# EAGLE design tap_test (EAGLE 9.6.2)
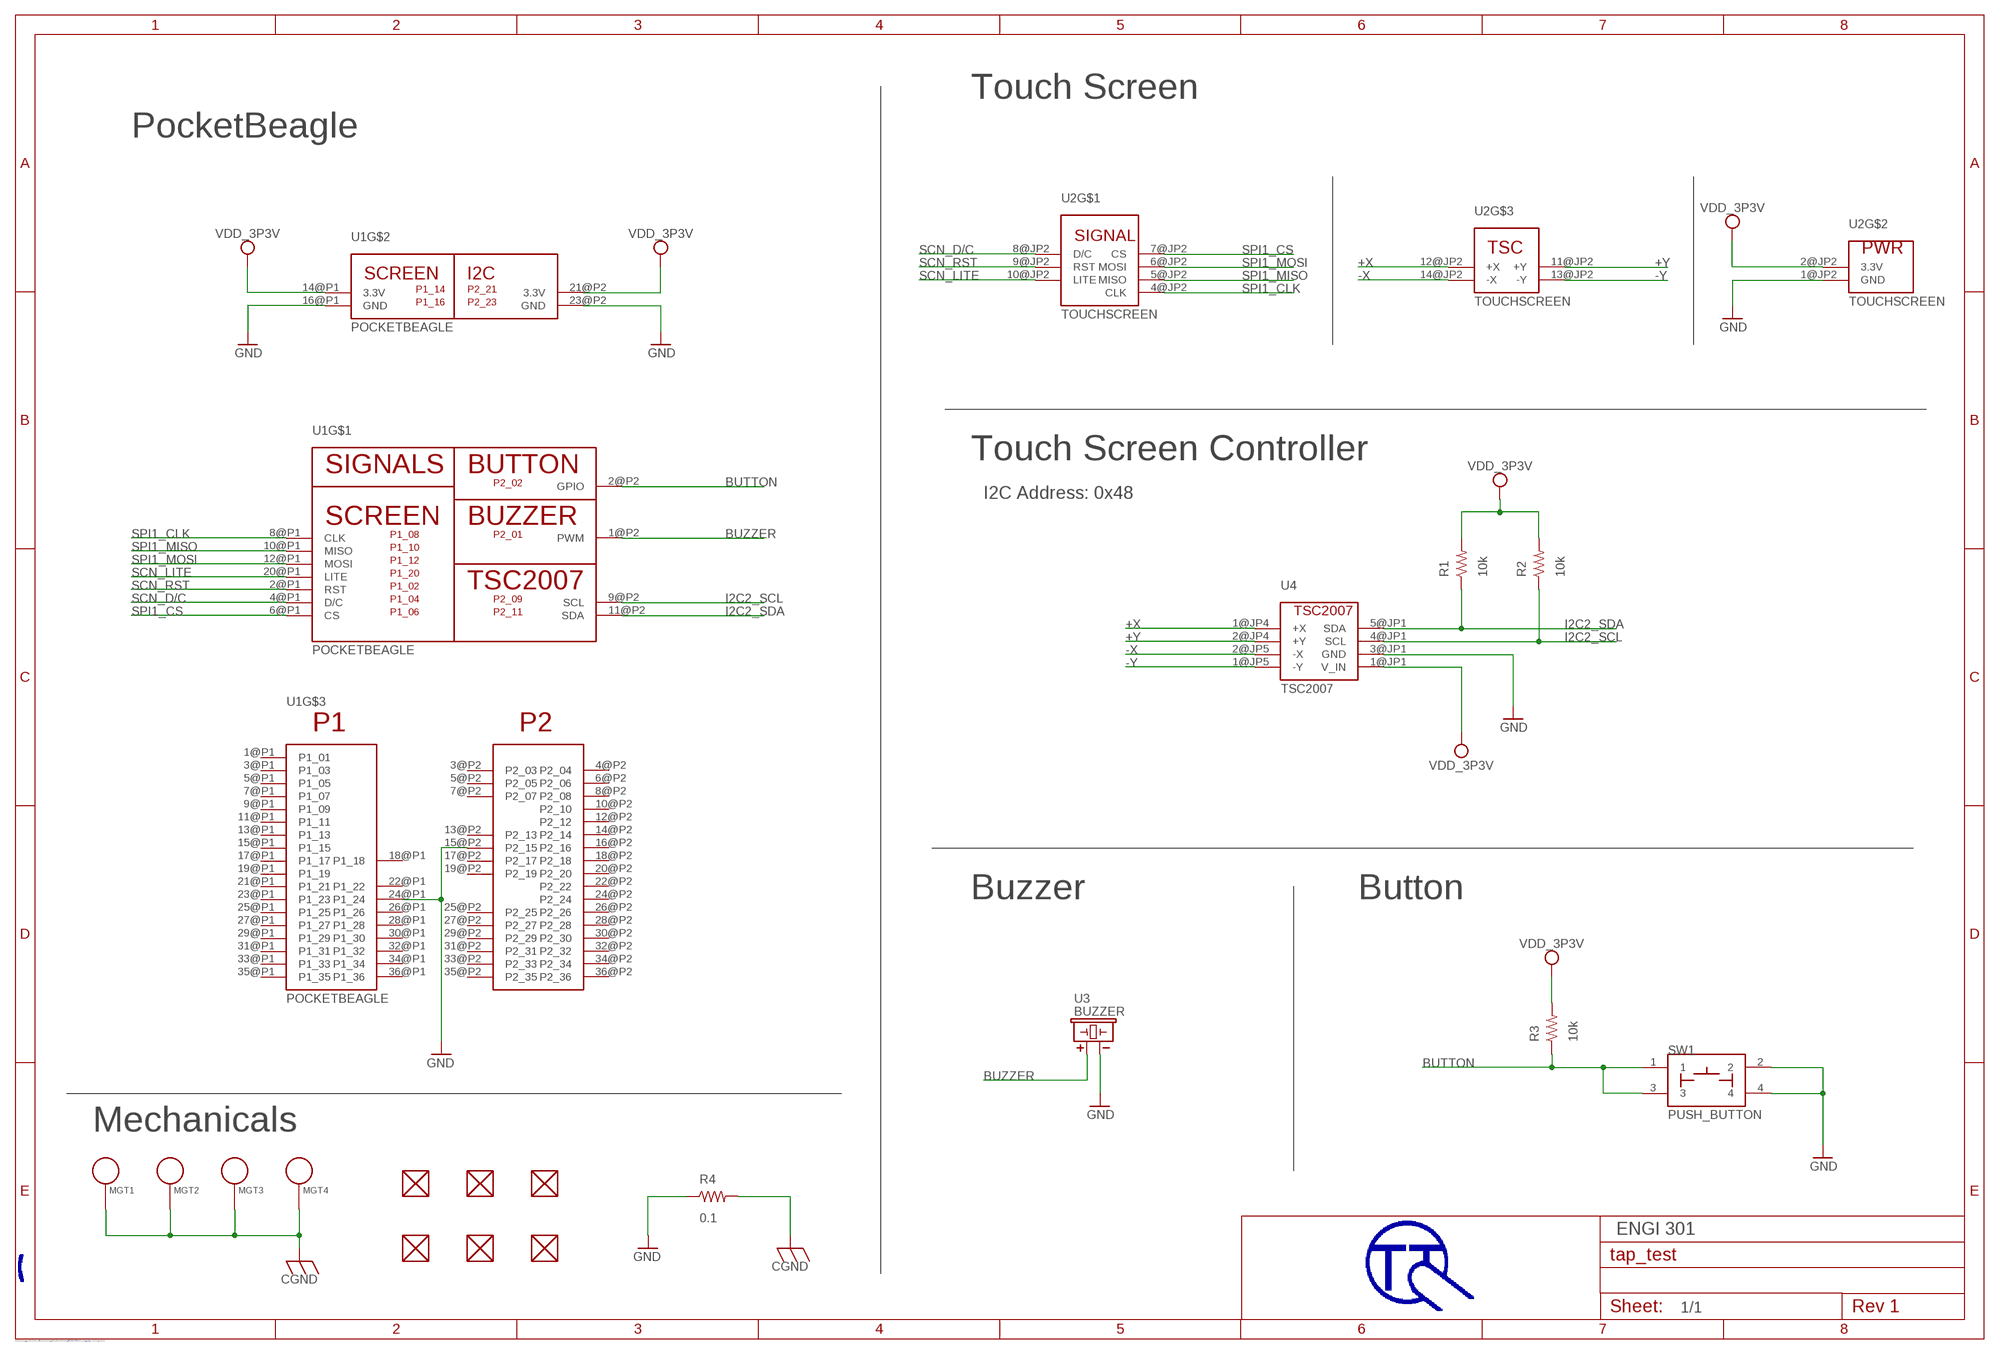
[diagram p0: schematic, sheet 1]

## Parts
FUD1  FIDUCIAL  [FIDUCIAL_40MIL]
FUD2  FIDUCIAL  [FIDUCIAL_40MIL]
FUD3  FIDUCIAL  [FIDUCIAL_40MIL]
FUD4  FIDUCIAL  [FIDUCIAL_40MIL]
FUD5  FIDUCIAL  [FIDUCIAL_40MIL]
FUD6  FIDUCIAL  [FIDUCIAL_40MIL]
MGT1  MOUNTING_HOLE  [MOUNTING_HOLE]
MGT2  MOUNTING_HOLE  [MOUNTING_HOLE]
MGT3  MOUNTING_HOLE  [MOUNTING_HOLE]
MGT4  MOUNTING_HOLE  [MOUNTING_HOLE]
R1  10k  R_R0603  [R0603]
R2  10k  R_R0603  [R0603]
R3  10k  R_R0603  [R0603]
R4  0.1  R_R0603  [R0603]
SW1  PUSH_BUTTON  [BUTTON_12.5MM]
U1  POCKETBEAGLE  [POCKETBEAGLE]
U2  TOUCHSCREEN  [TOUCHSCREEN]
U3  BUZZER  [BUZZER_6.5MM]
U4  TSC2007  [TSC2007]

## Nets
+X: U2.12@JP2(+X) U4.1@JP4(+X)
+Y: U2.11@JP2(+Y) U4.2@JP4(+Y)
-X: U2.14@JP2(-X) U4.2@JP5(-X)
-Y: U2.13@JP2(-Y) U4.1@JP5(-Y)
BUTTON: R3.1 SW1.1 SW1.3 U1.2@P2(GPIO)
BUZZER: U1.1@P2(PWM) U3.+
CGND: MGT1.P$1 MGT2.P$1 MGT3.P$1 MGT4.P$1 R4.2
GND: R4.1 SW1.2 SW1.4 U1.15@P2(P2_15) U1.16@P1(GND) U1.23@P2(GND) U1.24@P1(P1_24) U2.1@JP2(GND) U3.- U4.3@JP1(GND)
I2C2_SCL: R2.1 U1.9@P2(SCL) U4.4@JP1(SCL)
I2C2_SDA: R1.1 U1.11@P2(SDA) U4.5@JP1(SDA)
SCN_D/C: U1.4@P1(D/C) U2.8@JP2(D/C)
SCN_LITE: U1.20@P1(LITE) U2.10@JP2(LITE)
SCN_RST: U1.2@P1(RST) U2.9@JP2(RST)
SPI1_CLK: U1.8@P1(CLK) U2.4@JP2(CLK)
SPI1_CS: U1.6@P1(CS) U2.7@JP2(CS)
SPI1_MISO: U1.10@P1(MISO) U2.5@JP2(MISO)
SPI1_MOSI: U1.12@P1(MOSI) U2.6@JP2(MOSI)
VDD_3P3V: R1.2 R2.2 R3.2 U1.14@P1(3.3V) U1.21@P2(3.3V) U2.2@JP2(3.3V) U4.1@JP1(V_IN)
Unconnected: FUD1.P$1 FUD2.P$1 FUD3.P$1 FUD4.P$1 FUD5.P$1 FUD6.P$1 U1.1@P1(P1_01) U1.3@P1(P1_03) U1.3@P2(P2_03) U1.4@P2(P2_04) U1.5@P1(P1_05) U1.5@P2(P2_05) U1.6@P2(P2_06) U1.7@P1(P1_07) U1.7@P2(P2_07) U1.8@P2(P2_08) U1.9@P1(P1_09) U1.10@P2(P2_10) U1.11@P1(P1_11) U1.12@P2(P2_12) U1.13@P1(P1_13) U1.13@P2(P2_13) U1.14@P2(P2_14) U1.15@P1(P1_15) U1.16@P2(P2_16) U1.17@P1(P1_17) U1.17@P2(P2_17) U1.18@P1(P1_18) U1.18@P2(P2_18) U1.19@P1(P1_19) U1.19@P2(P2_19) U1.20@P2(P2_20) U1.21@P1(P1_21) U1.22@P1(P1_22) U1.22@P2(P2_22) U1.23@P1(P1_23) U1.24@P2(P2_24) U1.25@P1(P1_25) U1.25@P2(P2_25) U1.26@P1(P1_26) U1.26@P2(P2_26) U1.27@P1(P1_27) U1.27@P2(P2_27) U1.28@P1(P1_28) U1.28@P2(P2_28) U1.29@P1(P1_29) U1.29@P2(P2_29) U1.30@P1(P1_30) U1.30@P2(P2_30) U1.31@P1(P1_31) U1.31@P2(P2_31) U1.32@P1(P1_32) U1.32@P2(P2_32) U1.33@P1(P1_33) U1.33@P2(P2_33) U1.34@P1(P1_34) U1.34@P2(P2_34) U1.35@P1(P1_35) U1.35@P2(P2_35) U1.36@P1(P1_36) U1.36@P2(P2_36)

## Notes on the sheet
- Touch Screen
- PocketBeagle
- Touch Screen Controller | I2C Address: 0x48
- Buzzer | Button
- Mechanicals
- ENGI 301
- 1/1
- C:/Users/waywi/OneDrive - Rice University/Sophmore Spring/ENGI 301/pcb_design/tap_test_logo.bmp

## Library data of the parts
FUD1-FUD6 = tap_test:FIDUCIAL
MGT1-MGT4 = tap_test:MOUNTING_HOLE: Chassis Mounting Hole w/GND connection ability
R1-R4 = tap_test:R_: RESISTOR, American symbol
SW1 = tap_test:PUSH_BUTTON
U1 = tap_test:POCKETBEAGLE
U2 = tap_test:TOUCHSCREEN
U3 = tap_test:BUZZER: CEM-1203 Buzzer
U4 = tap_test:TSC2007

## Board
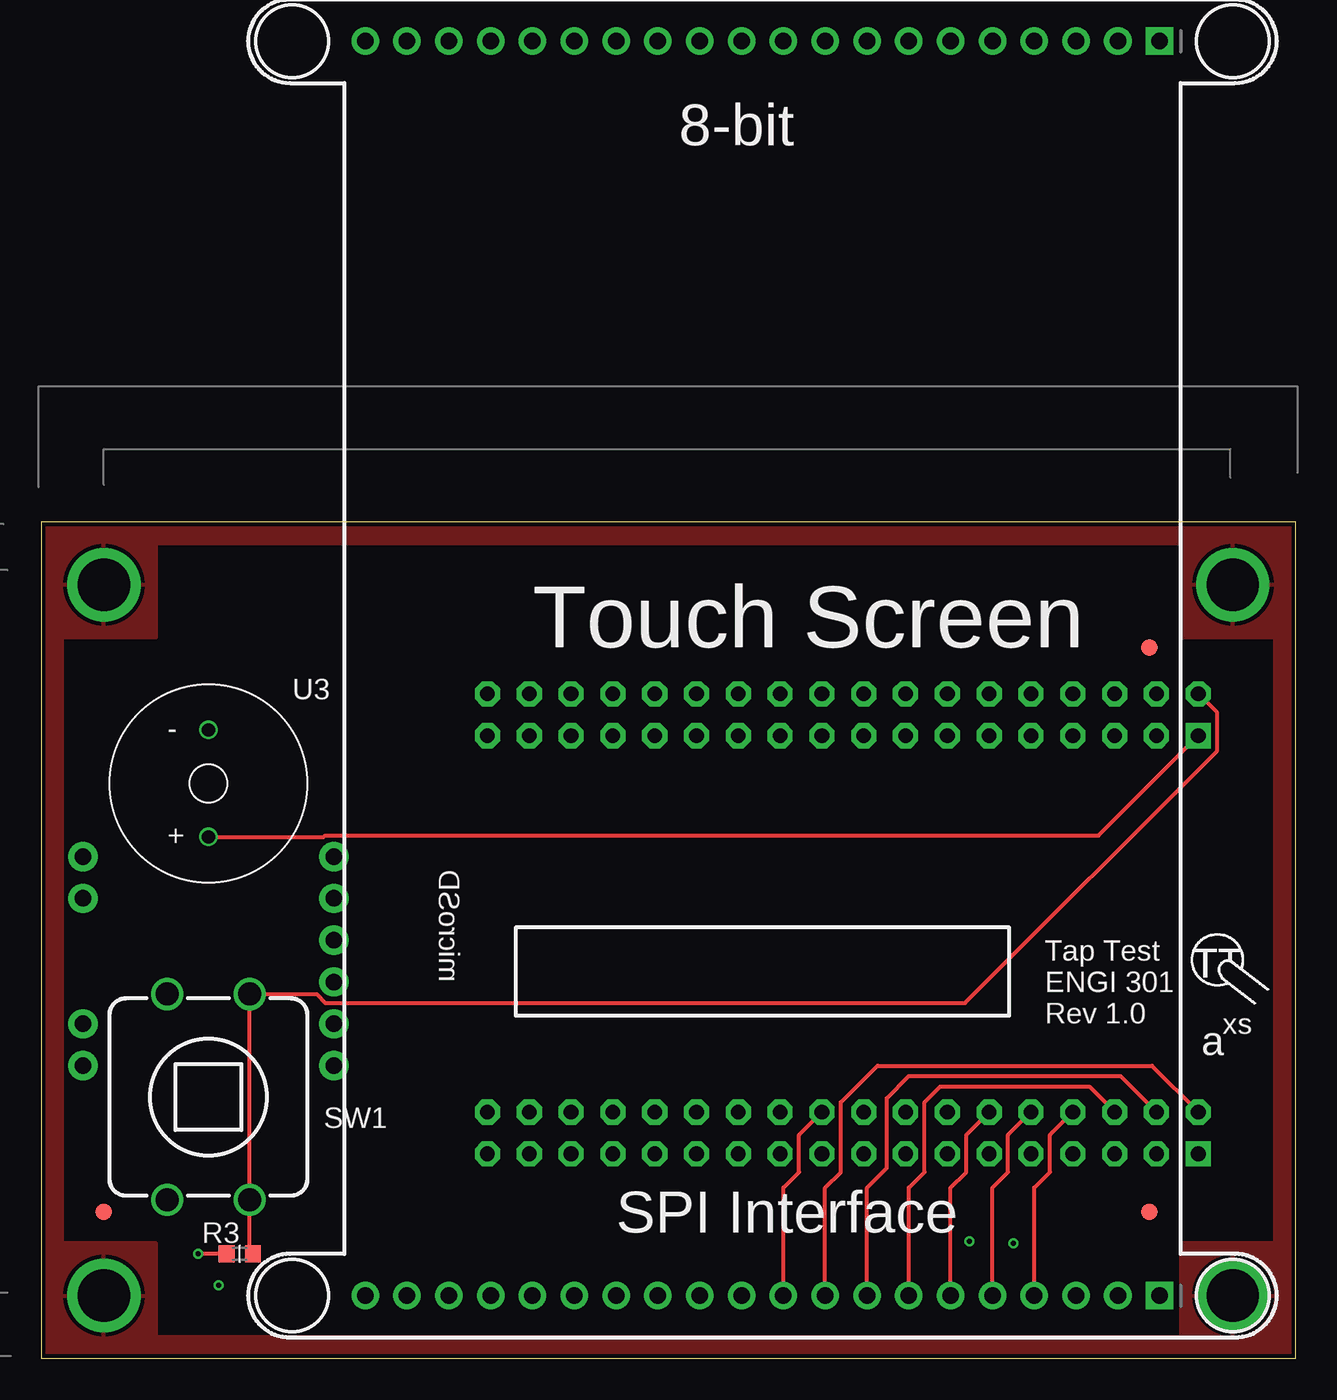
[diagram p1: board, top side]
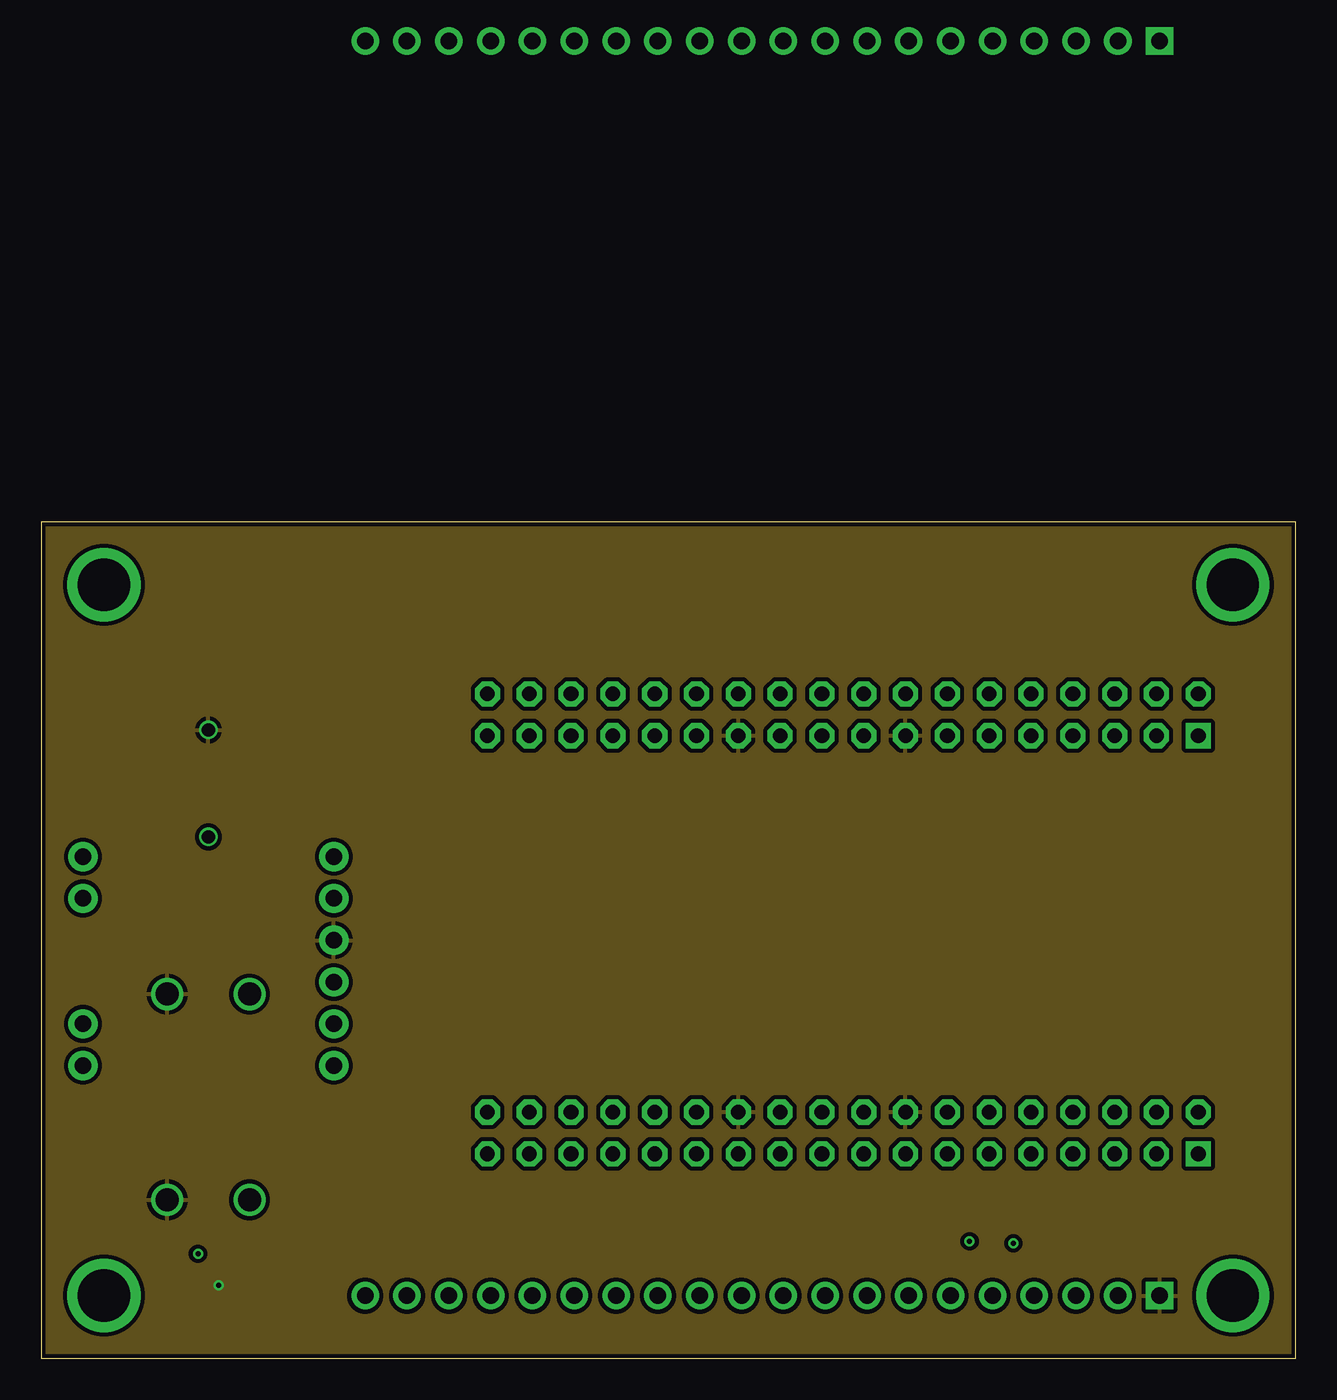
[diagram p2: board, inner layer Route2]
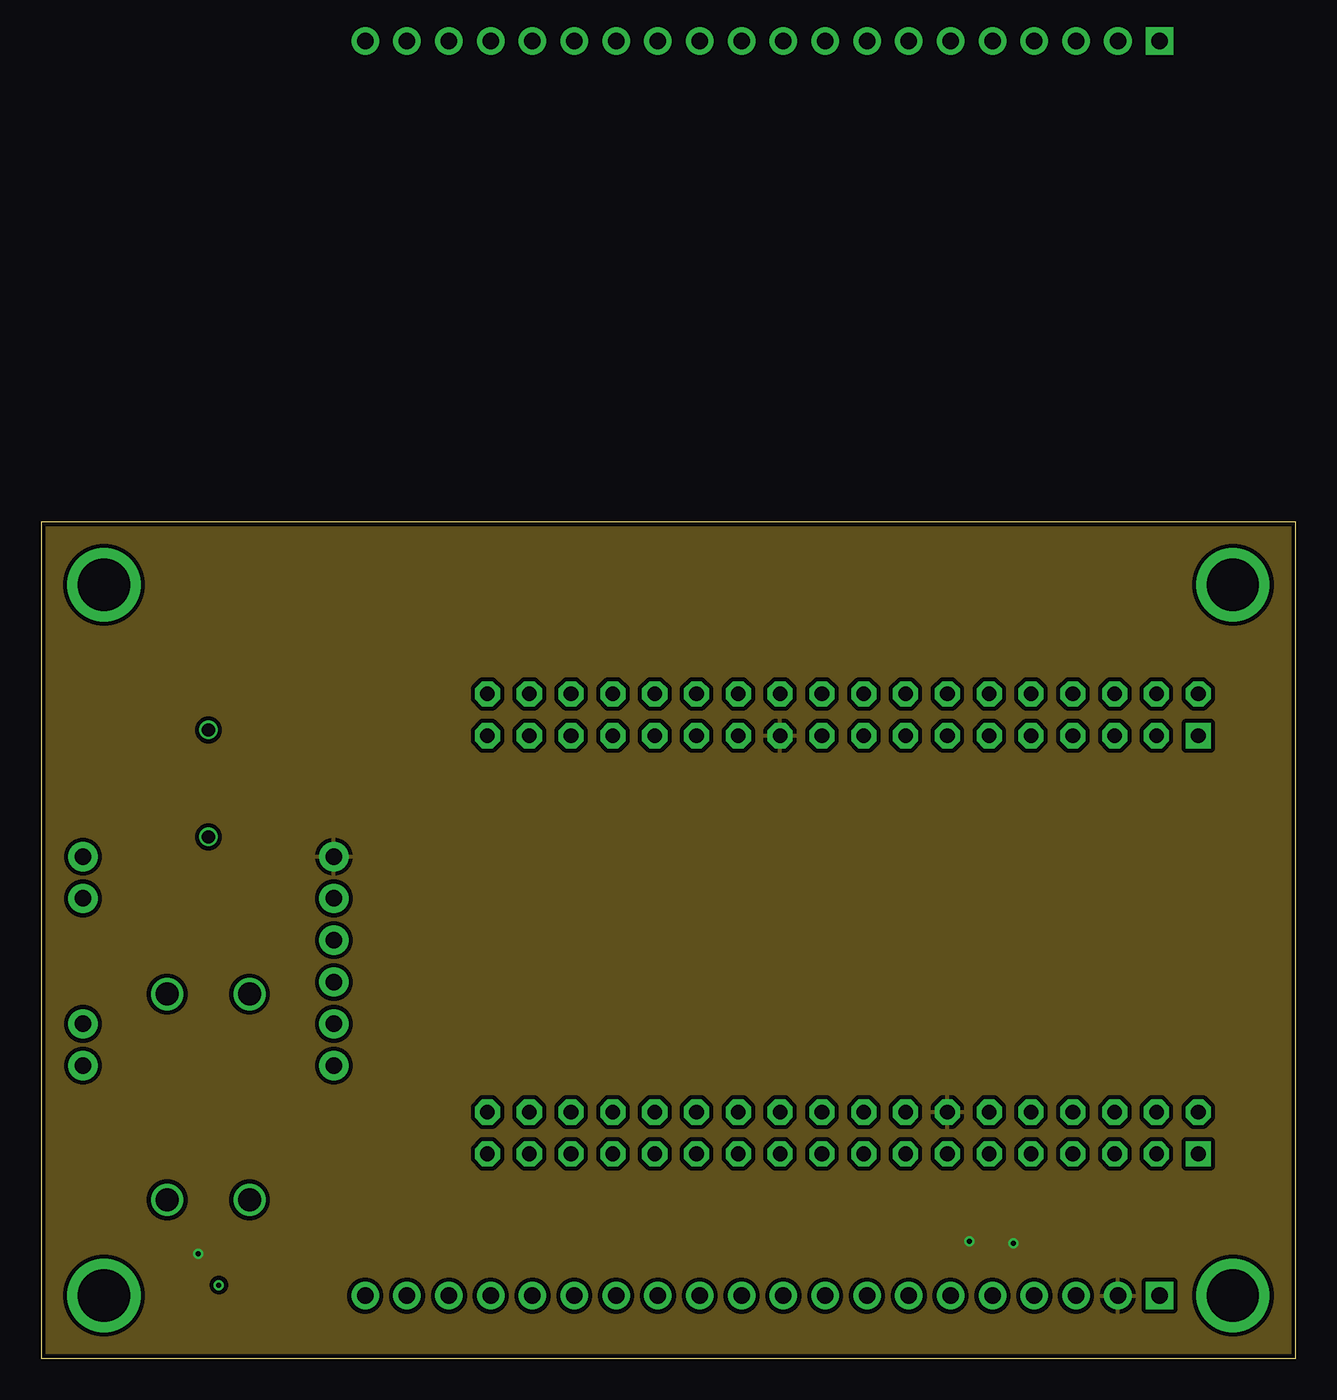
[diagram p3: board, inner layer Route15]
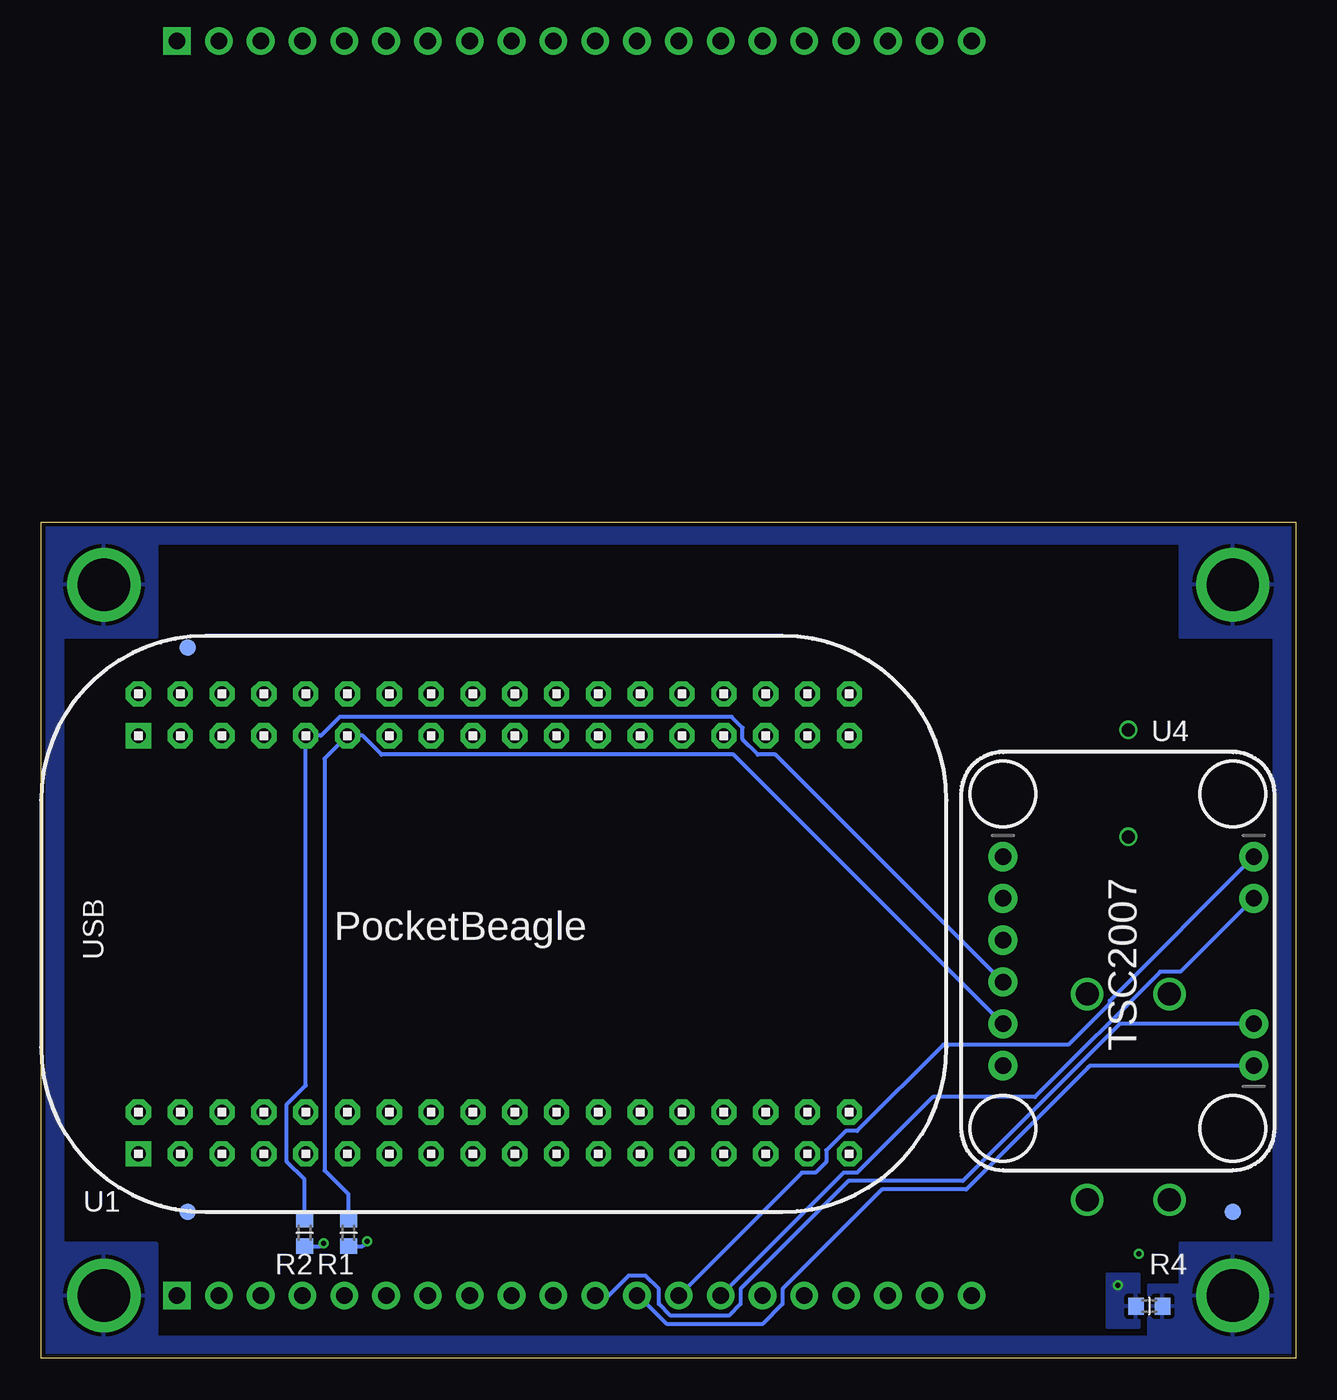
[diagram p4: board, bottom side, seen from below]

Size 76.2 x 50.8 mm. Coordinates in mm from the lower left corner, seen from the top.
Outline: 0,0 76.2,0 76.2,50.8 0,50.8 0,0
Copper layers (1*2*15*16): Top 0.035mm / dielectric 0.23mm / Route2 0.035mm / dielectric 0.93mm / Route15 0.035mm / dielectric 0.23mm / Bottom 0.035mm
Design rules "ENGI301_4lyr": minimum track width 10mil, minimum drill 12mil, track to track 10mil, track to pad 10mil, pad to pad 10mil, via to via 10mil, smd to smd 10mil, copper to edge 10mil, drill to drill 12mil, minimum pad ring 6mil, minimum via ring 6mil, stop-mask expansion 3mil, vias tented up to drill 25mil, thermal gap 10mil

### Footprints (pad centres in the part's own frame; a part is rotated, then mirrored left to right if it is on the bottom)
FIDUCIAL_40MIL = smd 1.016 x 1.016: P$1 0,0
MOUNTING_HOLE = drill 3.175 pad 4.445: P$1 0,0
R0603 = smd 0.95 x 1.031: 1 -0.8,0; 2 0.8,0
BUTTON_12.5MM = drill 1.4: 1 -6.25,2.5; 2 -6.25,-2.5; 3 6.25,2.5; 4 6.25,-2.5
POCKETBEAGLE = drill 0.889 pad 1.524 square: 1@P1 5.91,3.53; 1@P2 5.91,28.93 | drill 0.889 pad 1.524 octagon: 2@P1 5.91,6.07; 2@P2 5.91,31.47; 3@P1 8.45,3.53; 3@P2 8.45,28.93; 4@P1 8.45,6.07; 4@P2 8.45,31.47; 5@P1 10.99,3.53; 5@P2 10.99,28.93; 6@P1 10.99,6.07; 6@P2 10.99,31.47; 7@P1 13.53,3.53; 7@P2 13.53,28.93; 8@P1 13.53,6.07; 8@P2 13.53,31.47; 9@P1 16.07,3.53; 9@P2 16.07,28.93; 10@P1 16.07,6.07; 10@P2 16.07,31.47; 11@P1 18.61,3.53; 11@P2 18.61,28.93; 12@P1 18.61,6.07; 12@P2 18.61,31.47; 13@P1 21.15,3.53; 13@P2 21.15,28.93; 14@P1 21.15,6.07; 14@P2 21.15,31.47; 15@P1 23.69,3.53; 15@P2 23.69,28.93; 16@P1 23.69,6.07; 16@P2 23.69,31.47; 17@P1 26.23,3.53; 17@P2 26.23,28.93; 18@P1 26.23,6.07; 18@P2 26.23,31.47; 19@P1 28.77,3.53; 19@P2 28.77,28.93; 20@P1 28.77,6.07; 20@P2 28.77,31.47; 21@P1 31.31,3.53; 21@P2 31.31,28.93; 22@P1 31.31,6.07; 22@P2 31.31,31.47; 23@P1 33.85,3.53; 23@P2 33.85,28.93; 24@P1 33.85,6.07; 24@P2 33.85,31.47; 25@P1 36.39,3.53; 25@P2 36.39,28.93; 26@P1 36.39,6.07; 26@P2 36.39,31.47; 27@P1 38.93,3.53; 27@P2 38.93,28.93; 28@P1 38.93,6.07; 28@P2 38.93,31.47; 29@P1 41.47,3.53; 29@P2 41.47,28.93; 30@P1 41.47,6.07; 30@P2 41.47,31.47; 31@P1 44.01,3.53; 31@P2 44.01,28.93; 32@P1 44.01,6.07; 32@P2 44.01,31.47; 33@P1 46.55,3.53; 33@P2 46.55,28.93; 34@P1 46.55,6.07; 34@P2 46.55,31.47; 35@P1 49.09,3.53; 35@P2 49.09,28.93; 36@P1 49.09,6.07; 36@P2 49.09,31.47
TOUCHSCREEN = drill 1 pad 1.676 square: 1@JP1 24.13,38.1; 1@JP2 24.13,-38.1 | drill 1 pad 1.676: 2@JP1 21.59,38.1; 2@JP2 21.59,-38.1; 3@JP1 19.05,38.1; 3@JP2 19.05,-38.1; 4@JP1 16.51,38.1; 4@JP2 16.51,-38.1; 5@JP1 13.97,38.1; 5@JP2 13.97,-38.1; 6@JP1 11.43,38.1; 6@JP2 11.43,-38.1; 7@JP1 8.89,38.1; 7@JP2 8.89,-38.1; 8@JP1 6.35,38.1; 8@JP2 6.35,-38.1; 9@JP1 3.81,38.1; 9@JP2 3.81,-38.1; 10@JP1 1.27,38.1; 10@JP2 1.27,-38.1; 11@JP1 -1.27,38.1; 11@JP2 -1.27,-38.1; 12@JP1 -3.81,38.1; 12@JP2 -3.81,-38.1; 13@JP1 -6.35,38.1; 13@JP2 -6.35,-38.1; 14@JP1 -8.89,38.1; 14@JP2 -8.89,-38.1; 15@JP1 -11.43,38.1; 15@JP2 -11.43,-38.1; 16@JP1 -13.97,38.1; 16@JP2 -13.97,-38.1; 17@JP1 -16.51,38.1; 17@JP2 -16.51,-38.1; 18@JP1 -19.05,38.1; 18@JP2 -19.05,-38.1; 19@JP1 -21.59,38.1; 19@JP2 -21.59,-38.1; 20@JP1 -24.13,38.1; 20@JP2 -24.13,-38.1
BUZZER_6.5MM = drill 0.8: + 0,-3.25; - 0,3.25
TSC2007 = drill 1 pad 1.778: 1@JP1 6.35,2.54; 1@JP4 19.05,17.78; 1@JP5 6.35,17.78; 2@JP1 8.89,2.54; 2@JP4 16.51,17.78; 2@JP5 8.89,17.78; 3@JP1 11.43,2.54; 4@JP1 13.97,2.54; 5@JP1 16.51,2.54; 6@JP1 19.05,2.54

### Placement (x,y rotation side)
FUD1  67.31,43.18 0 top
FUD2  67.31,43.18 0 bottom
FUD3  67.31,8.89 0 bottom
FUD4  3.81,8.89 180 bottom
FUD5  67.31,8.89 0 top
FUD6  3.81,8.89 0 top
MGT1  3.81,46.99 0 top
MGT2  72.39,46.99 0 top
MGT3  72.39,3.81 0 top
MGT4  3.81,3.81 180 top
R1  57.53,7.62 270 bottom
R2  60.2,7.62 270 bottom
R3  12.06,6.35 180 top
R4  8.89,3.17 0 bottom
SW1  10.16,15.88 270 top
U1  76.2,8.89 0 bottom
U2  43.81,41.91 0 top
U3  10.16,34.92 0 top
U4  20.32,36.83 270 bottom

### Tracks (layer width: path | path; a pad name or v marks a point on that pad's centre or on a via)
+X
  Bottom 0.254: U2.12@JP2 39.91,3.81 38.18,2.08 32.39,2.08 31.17,3.31 31.17,4.21 25.12,10.26 20.01,10.26 12.6,17.68 12.49,17.78 U4.1@JP4
+Y
  Bottom 0.254: U2.11@JP2 41.73,3.81 40.51,5.03 39.5,5.03 38.68,4.21 38.68,3.31 37.97,2.59 34.42,2.59 33.71,3.31 33.71,4.21 27.15,10.77 20.22,10.77 10.67,20.32 U4.2@JP4
-X
  Bottom 0.254: U4.2@JP5 6.99,23.49 8.22,23.49 15.84,15.88 22.04,15.88 26.64,11.28 27.46,11.28 U2.14@JP2
-Y
  Bottom 0.254: U4.1@JP5 11.3,21.72 11.3,21.56 13.81,19.05 21.4,19.05 26.64,13.82 27.33,13.82 28.51,12.64 28.51,11.95 29.18,11.28 30,11.28 U2.13@JP2
BUTTON
  Top 0.254: R3.1 12.66,6.55 SW1.3 SW1.1 16.72,22.12 17.25,21.59 56.12,21.59 71.43,36.9 71.43,39.22 U1.2@P2
BUZZER
  Top 0.254: U3.+ 17.18,31.68 17.25,31.75 64.22,31.75 U1.1@P2
CGND
  pour Top: 1.27,25.4 1.27,43.81 6.99,43.81 6.99,49.53 69.22,49.53 69.22,43.81 74.93,43.81 74.93,25.4 76.83,25.4 76.83,51.44 -0.64,51.44 -0.64,25.4
  pour Top: -0.64,25.4 -0.64,-0.64 76.83,-0.64 76.83,25.4 74.93,25.4 74.93,6.99 69.22,6.99 69.22,1.27 6.99,1.27 6.99,6.99 1.27,6.99 1.27,25.4
  pour Bottom: -0.64,25.4 1.27,25.4 1.27,43.81 6.99,43.81 6.99,49.53 69.22,49.53 69.22,43.81 74.93,43.81 74.93,25.4 76.83,25.4 76.83,51.44 -0.64,51.44
  pour Bottom: -0.64,25.4 -0.64,-0.64 76.83,-0.64 76.83,25.4 74.93,25.4 74.93,6.99 69.22,6.99 69.22,1.27 8.89,1.27 8.89,4.45 6.99,4.45 6.99,6.99 1.27,6.99 1.27,25.4
GND  (via drill 0.3 pad 0.61)
  other vias: 10.79,4.45
  pour Route2: -2.54,-2.54 -2.54,53.34 78.74,53.34 78.74,-2.54
  pour Bottom: 9.53,5.08 11.43,5.08 11.43,1.91 9.53,1.91
I2C2_SCL
  Bottom 0.254: U4.4@JP1 31.6,36.68 32.66,36.68 33.59,37.6 33.59,38.29 34.26,38.96 58.06,38.96 59.21,37.82 U1.9@P2 60.13,16.58 61.27,15.43 61.27,11.95 60.2,10.87 R2.1
I2C2_SDA
  Bottom 0.254: U4.5@JP1 34.14,36.68 55.52,36.68 56.67,37.82 U1.11@P2 58.99,36.42 58.99,11.41 57.53,9.95 R1.1
SCN_D/C
  Top 0.254: U1.4@P1 65.56,17.14 52.7,17.14 51.37,15.81 51.37,11.57 50.16,10.36 U2.8@JP2
SCN_LITE
  Top 0.254: U2.10@JP2 45.09,10.36 46.03,11.31 46.03,13.56 U1.20@P1
SCN_RST
  Top 0.254: U1.2@P1 67.47,17.78 50.8,17.78 48.57,15.55 48.57,11.31 47.62,10.36 U2.9@JP2
SPI1_CLK
  Top 0.254: U2.4@JP2 60.33,10.36 61.27,11.31 61.27,13.56 U1.8@P1
SPI1_CS
  Top 0.254: U1.6@P1 63.66,16.51 54.61,16.51 53.65,15.55 53.65,11.31 52.7,10.36 U2.7@JP2
SPI1_MISO
  Top 0.254: U2.5@JP2 57.78,10.36 58.73,11.31 58.73,13.56 U1.10@P1
SPI1_MOSI
  Top 0.254: U2.6@JP2 55.24,10.36 56.19,11.31 56.19,13.56 U1.12@P1
VDD_3P3V  (via drill 0.3 pad 0.61)
  Top 0.254: R3.2 v9.53,6.35
  Bottom 0.254: v59.05,6.99 59.22,6.82 R2.2 | v56.39,7.11 56.68,6.82 R1.2
  pour Route15: -5.08,-5.08 -5.08,55.88 81.28,55.88 81.28,-5.08

### Text on the board
tPlace: Tap Test | ENGI 301 | C:/Users/waywi/OneDrive - Rice University/Sophmore Spring/ENGI 301/pcb_design/tap_test_logo.bmp | Rev 1.0 | xs | a
tDocu: 3.00 | 2.70 | 2.00 | 1.70